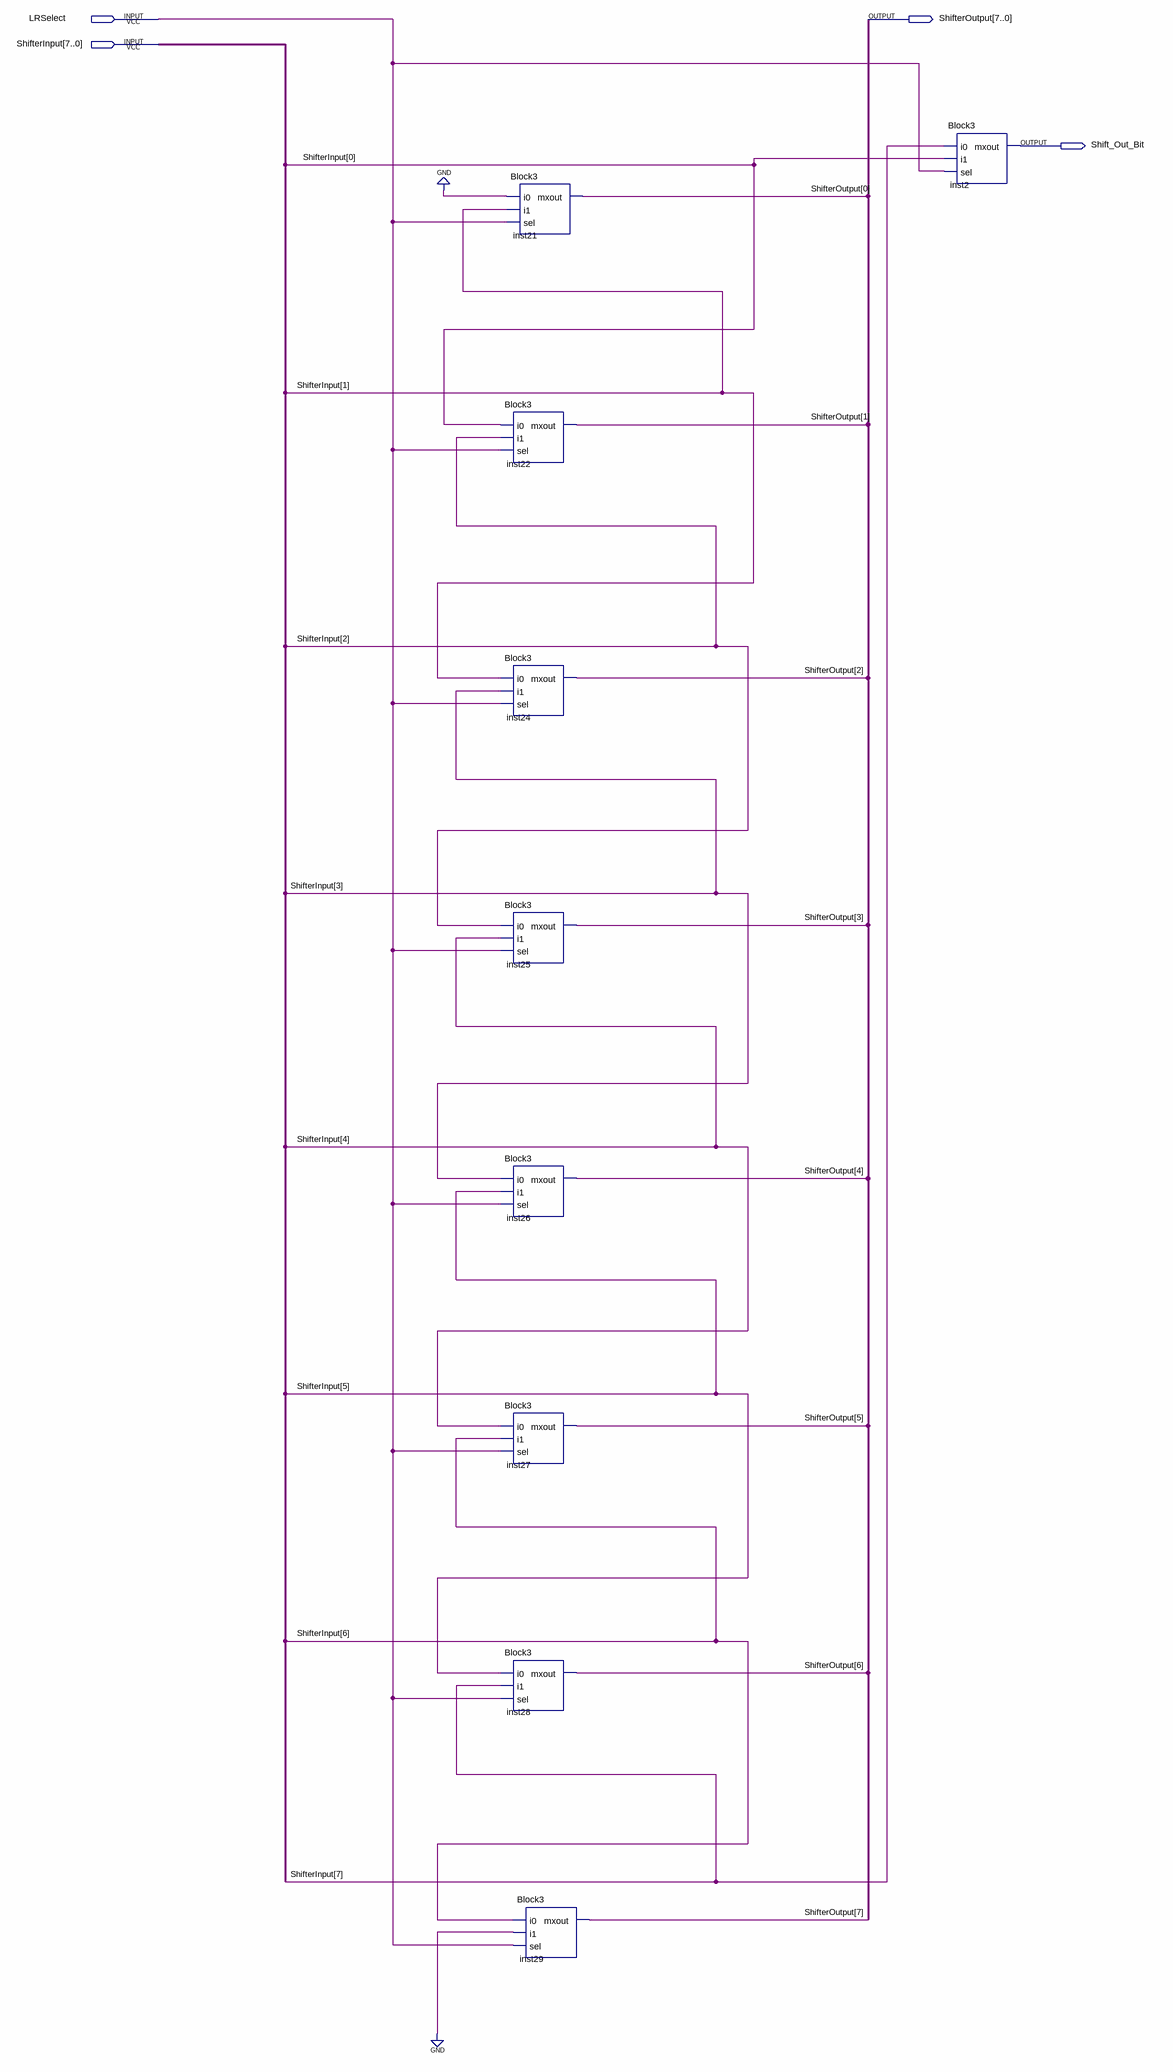
[diagram p0: schematic sheet]
// Quartus schematic ShiftNoDff.bdf as structural Verilog: 9 symbols, 4 pins
module ShiftNoDff (
  input  LRSelect,
  input  [7:0] ShifterInput,
  output [7:0] ShifterOutput,
  output Shift_Out_Bit
);

  Block3 inst22 (.i0(ShifterInput[0]), .i1(ShifterInput[2]), .sel(LRSelect), .mxout(ShifterOutput[1]));
  Block3 inst24 (.i0(ShifterInput[1]), .i1(ShifterInput[3]), .sel(LRSelect), .mxout(ShifterOutput[2]));
  Block3 inst25 (.i0(ShifterInput[2]), .i1(ShifterInput[4]), .sel(LRSelect), .mxout(ShifterOutput[3]));
  Block3 inst26 (.i0(ShifterInput[3]), .i1(ShifterInput[5]), .sel(LRSelect), .mxout(ShifterOutput[4]));
  Block3 inst27 (.i0(ShifterInput[4]), .i1(ShifterInput[6]), .sel(LRSelect), .mxout(ShifterOutput[5]));
  Block3 inst28 (.i0(ShifterInput[5]), .i1(ShifterInput[7]), .sel(LRSelect), .mxout(ShifterOutput[6]));
  Block3 inst21 (.i0(1'b0), .i1(ShifterInput[1]), .sel(LRSelect), .mxout(ShifterOutput[0]));
  Block3 inst29 (.i0(ShifterInput[6]), .i1(1'b0), .sel(LRSelect), .mxout(ShifterOutput[7]));
  Block3 inst2 (.i0(ShifterInput[7]), .i1(ShifterInput[0]), .sel(LRSelect), .mxout(Shift_Out_Bit));
endmodule
